# EAGLE schematic CarloopStick-v1.1 (EAGLE 9.1.0)
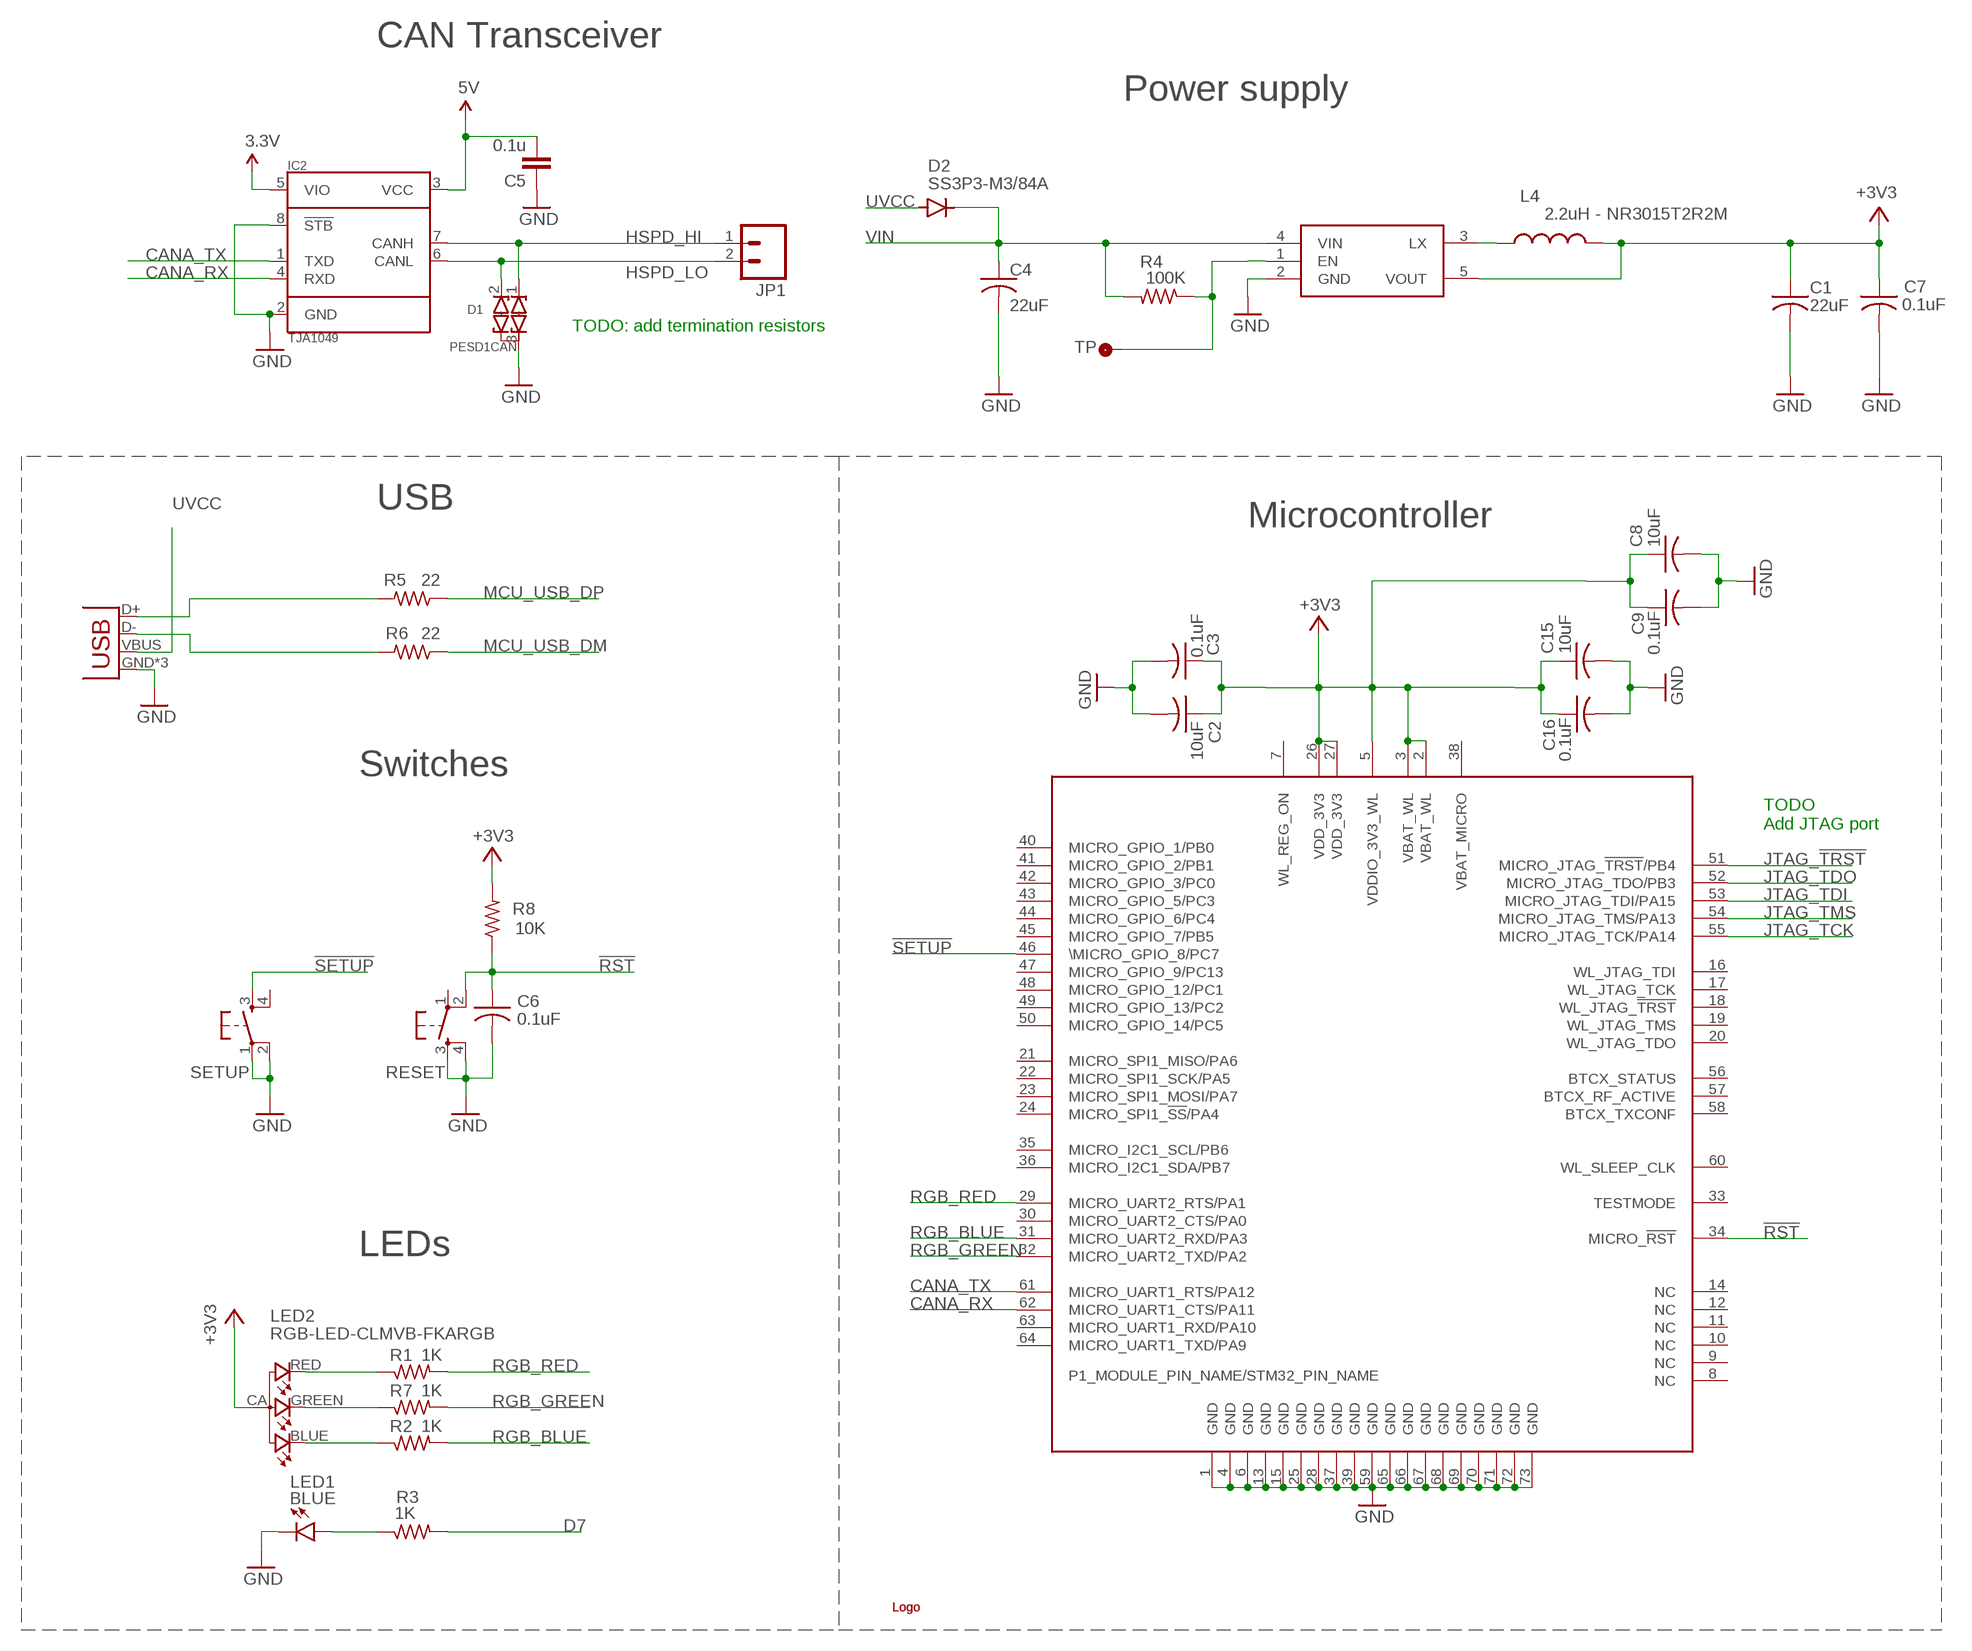
[diagram p0: schematic, sheet 1]

## Parts
C1  22uF  C-US0603  [C0603_B]
C2  10uF  C-US0603  [C0603_B]
C3  0.1uF  C-US  [C0402_B]
C4  22uF  C-US0603  [C0603_B]
C5  0.1u  C-EUC0402  [C0402]
C6  0.1uF  C-US  [C0402_B]
C7  0.1uF  C-US  [C0402_B]
C8  10uF  C-US0603  [C0603_B]
C9  0.1uF  C-US  [C0402_B]
C15  10uF  C-US0603  [C0603_B]
C16  0.1uF  C-US  [C0402_B]
D1  PESD1CAN  DIODE_ESD_DUAL-SOT-23  [SOT23]
D2  SS3P3-M3/84A  DIODE  [DIODE-DO-220AA(SMP)]
IC2  TJA1049  [SO8]
JP1  M02PTH  [1X02]
L4  2.2uH - NR3015T2R2M  INDUCTORB  [INDUCTOR-NR3015]
LED2  RGB-LED-CLMVB-FKARGB  [PLCC4-2MM-RGB]
LED_USR  BLUE  LED-0603-NO-SS  [LED-0603-NO-SS]
R1  1K  R-US_  [R0402_B]
R2  1K  R-US_  [R0402_B]
R3  1K  R-US_  [R0402_B]
R4  100K  R-US_  [R0402_B]
R5  22  R-US_  [R0402_B]
R6  22  R-US_  [R0402_B]
R7  1K  R-US_  [R0402_B]
R8  10K  R-US_  [R0402_B]
RESET  KMR211GLFS  TAC_SWITCHSMD  [TACTILE_SWITCH_SMD]
SETUP  KMR211GLFS  TAC_SWITCHSMD  [TACTILE_SWITCH_SMD]
U$1  LOGOSMALL  [CARLOOP-2]
U$4  P1  [WM-N-BM-14]
U$5  LOGOSMALL  [CARLOOP-2]
U$11  R8008-33  [SOT23-5]
U$12  TP3  [TP60_BOT]
X1  USB-MICROB  USBUSB-MICROB-SLOT-HOLE  [USB-MICROB-SLOT-HOLE]

## Nets
3.3V: IC2.5(VIO)
5V: C5.2 IC2.3(VCC)
!RST: C6.1 R8.1 RESET.2 U$4.34(MICRO_!RST!)
!SETUP: SETUP.3 U$4.46(\MICRO_GPIO_8/PC7)
+3V3: C1.1 C2.1 C3.1 C7.1 C8.1 C9.1 C15.1 C16.1 L4.2 LED2.CA R8.2 U$4.2(VBAT_WL) U$4.3(VBAT_WL) U$4.5(VDDIO_3V3_WL) U$4.26(VDD_3V3) U$4.27(VDD_3V3) U$11.5(VOUT)
CANA_RX: IC2.4(RXD) U$4.62(MICRO_UART1_CTS/PA11)
CANA_TX: IC2.1(TXD) U$4.61(MICRO_UART1_RTS/PA12)
D7: R3.2
GND: C1.2 C2.2 C3.2 C4.2 C5.1 C6.2 C7.2 C8.2 C9.2 C15.2 C16.2 D1.3(COM) IC2.2(GND) IC2.8(!STB) LED_USR.C1(C) RESET.3 RESET.4 SETUP.1 SETUP.2 U$4.1(GND) U$4.4(GND) U$4.6(GND) U$4.13(GND) U$4.15(GND) U$4.25(GND) U$4.28(GND) U$4.37(GND) U$4.39(GND) U$4.59(GND) U$4.65(GND) U$4.66(GND) U$4.67(GND) U$4.68(GND) U$4.69(GND) U$4.70(GND) U$4.71(GND) U$4.72(GND) U$4.73(GND) U$11.2(GND) X1.GND X1.MT1(GND) X1.MT2(GND)
HSPD_HI: D1.1(C1) IC2.7(CANH) JP1.1
HSPD_LO: D1.2(C2) IC2.6(CANL) JP1.2
JTAG_!TRST: U$4.51(MICRO_JTAG_!TRST!/PB4)
JTAG_TCK: U$4.55(MICRO_JTAG_TCK/PA14)
JTAG_TDI: U$4.53(MICRO_JTAG_TDI/PA15)
JTAG_TDO: U$4.52(MICRO_JTAG_TDO/PB3)
JTAG_TMS: U$4.54(MICRO_JTAG_TMS/PA13)
LED1: LED_USR.A1(A) R3.1
MCU_USB_DM: R6.1
MCU_USB_DP: R5.1
N$1: R5.2 X1.D+
N$3: L4.1 U$11.3(LX)
N$6: R6.2 X1.D-
N$7 [vcc]: R4.1 U$11.1(EN) U$12.P$1(TP)
N$27: LED2.BLUE R2.1
N$29: LED2.GREEN R7.1
N$54: LED2.RED R1.1
RGB_BLUE: R2.2 U$4.31(MICRO_UART2_RXD/PA3)
RGB_GREEN [vcc]: R7.2 U$4.32(MICRO_UART2_TXD/PA2)
RGB_RED: R1.2 U$4.29(MICRO_UART2_RTS/PA1)
UVCC: D2.ANODE X1.VBUS
VIN [vcc]: C4.1 D2.CATHODE R4.2 U$11.4(VIN)
Unconnected: RESET.1 SETUP.4 U$4.7(WL_REG_ON) U$4.8(NC) U$4.9(NC) U$4.10(NC) U$4.11(NC) U$4.12(NC) U$4.14(NC) U$4.16(WL_JTAG_TDI) U$4.17(WL_JTAG_TCK) U$4.18(WL_JTAG_!TRST!) U$4.19(WL_JTAG_TMS) U$4.20(WL_JTAG_TDO) U$4.21(MICRO_SPI1_MISO/PA6) U$4.22(MICRO_SPI1_SCK/PA5) U$4.23(MICRO_SPI1_MOSI/PA7) U$4.24(MICRO_SPI1_!SS!/PA4) U$4.30(MICRO_UART2_CTS/PA0) U$4.33(TESTMODE) U$4.35(MICRO_I2C1_SCL/PB6) U$4.36(MICRO_I2C1_SDA/PB7) U$4.38(VBAT_MICRO) U$4.40(MICRO_GPIO_1/PB0) U$4.41(MICRO_GPIO_2/PB1) U$4.42(MICRO_GPIO_3/PC0) U$4.43(MICRO_GPIO_5/PC3) U$4.44(MICRO_GPIO_6/PC4) U$4.45(MICRO_GPIO_7/PB5) U$4.47(MICRO_GPIO_9/PC13) U$4.48(MICRO_GPIO_12/PC1) U$4.49(MICRO_GPIO_13/PC2) U$4.50(MICRO_GPIO_14/PC5) U$4.56(BTCX_STATUS) U$4.57(BTCX_RF_ACTIVE) U$4.58(BTCX_TXCONF) U$4.60(WL_SLEEP_CLK) U$4.63(MICRO_UART1_RXD/PA10) U$4.64(MICRO_UART1_TXD/PA9)

## Notes on the sheet
- CAN Transceiver
- Power supply
- TODO: add termination resistors
- USB
- Microcontroller
- Switches
- TODO
  Add JTAG port
- LEDs

## Library data of the parts
C1 C2 C4 C8 C15 = Bretts-Spark-Library:C-US: Capacitor
C3 C6 C7 C9 C16 = Spark:C-US: Capacitor
C5 = rcl:C-EU: CAPACITOR, European symbol; PARTNO: GRM155R71C104KA88D
D1 = MuniRent:DIODE_ESD_DUAL: Dual ESD Diode, with a common anode; PARTNO: PESD1CAN-215
D2 = Spark:DIODE
IC2 = MuniRent:TJA1049; PARTNO: TJA1049T-118
JP1 = SparkFun-Connectors:M02: Standard 2-pin 0.1" header. Use with - straight break away headers ( PRT-00116) - right angle break away headers (PRT-00553) - swiss pins (PRT-00743) - machine pins (PRT-00117) - female headers (PRT-00115) Molex polarized connector foot print use with: PRT-08233 with associated crimp pins and housings. 2.54_SCREWTERM for use with PRT-10571. 3.5mm Screw Terminal footprints for PRT-08084 5mm Screw Terminal footprints for use with PRT-08432
L4 = Spark:INDUCTOR
LED2 = Spark:RGB-LED-CLMVB-FKA: CREE CLMVB-FKA RGB LED 2mm x 2mm
LED_USR = Bretts-Spark-Library:LED
R1-R8 = Spark:R-US_: 0402 Resistor
RESET SETUP = Spark:TAC_SWITCH: SMD Tactiile Switch
U$1 U$5 = MuniRent:LOGO; BOM: EXCLUDE
U$4 = Particle-Devices:P1: Particle P1 module (WiFi with antenna) Product datasheet: here <https://docs.particle.io/datasheets/photon-(wifi)/p1-datasheet/> Github : Particle devices library <https://github.com/particle-iot/hardware-libraries/tree/master/Eagle>
U$11 = Spark:R8008-33
U$12 = Spark:TP: Test Points of all sizes and shapes
X1 = Spark:USB